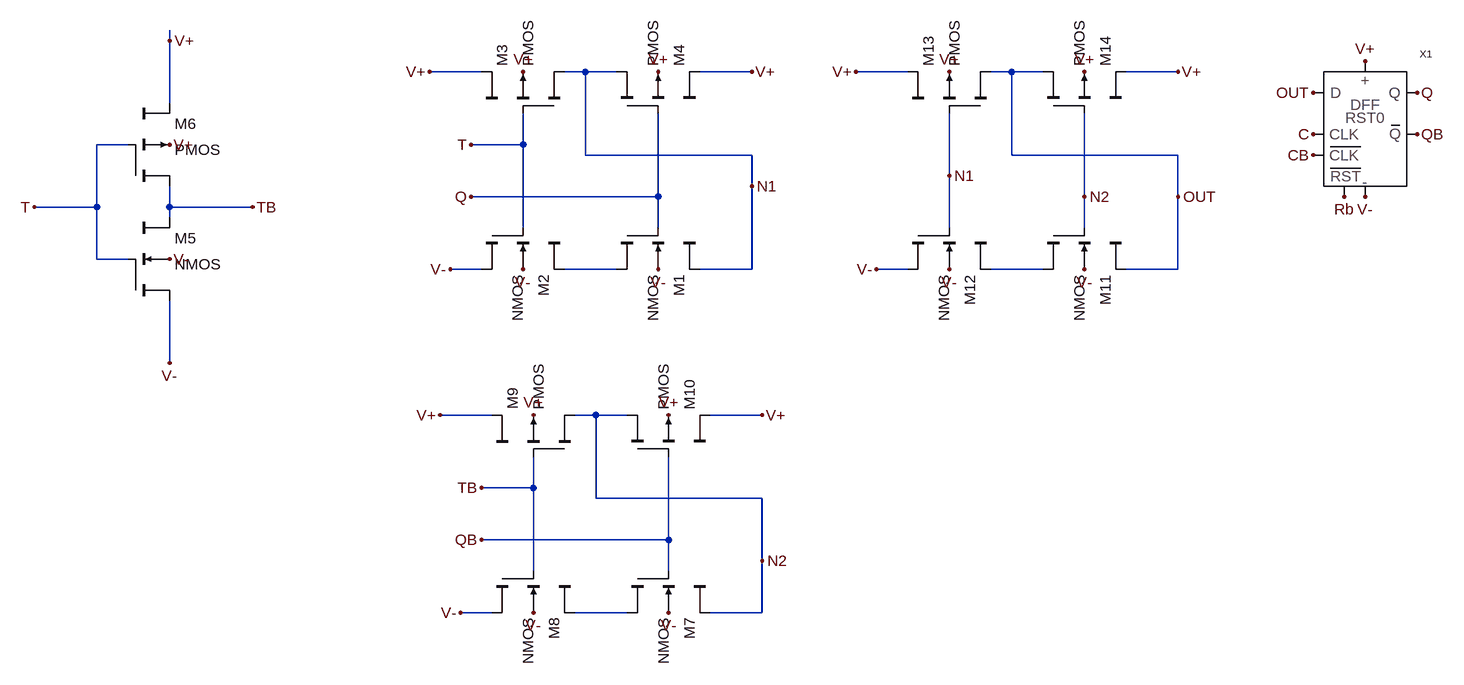
[diagram p0: schematic ToggleFlipFlop_Low_LDS.asc]
ToggleFlipFlop_Low_LDS.asc, the LTspice schematic file:
Version 4
SHEET 1 3292 1708
WIRE -1024 272 -1024 256
WIRE -544 320 -624 320
WIRE -384 320 -416 320
WIRE -336 320 -384 320
WIRE -128 320 -208 320
WIRE 112 320 32 320
WIRE 272 320 240 320
WIRE 320 320 272 320
WIRE 528 320 448 320
WIRE -1024 368 -1024 272
WIRE -1088 432 -1136 432
WIRE -480 432 -480 384
WIRE -480 432 -560 432
WIRE -384 448 -384 320
WIRE -128 448 -384 448
WIRE 272 448 272 320
WIRE 528 448 272 448
WIRE 176 480 176 384
WIRE -128 496 -128 448
WIRE -272 512 -272 384
WIRE -272 512 -560 512
WIRE 384 512 384 384
WIRE 528 512 528 448
WIRE -1136 528 -1136 432
WIRE -1136 528 -1232 528
WIRE -1024 528 -1024 496
WIRE -896 528 -1024 528
WIRE -1024 544 -1024 528
WIRE -480 560 -480 432
WIRE -272 560 -272 512
WIRE 176 560 176 480
WIRE 384 560 384 512
WIRE -1136 608 -1136 528
WIRE -1088 608 -1136 608
WIRE -544 624 -592 624
WIRE -336 624 -416 624
WIRE -128 624 -128 496
WIRE -128 624 -208 624
WIRE 112 624 64 624
WIRE 320 624 240 624
WIRE 528 624 528 512
WIRE 528 624 448 624
WIRE -1024 768 -1024 672
WIRE -528 848 -608 848
WIRE -368 848 -400 848
WIRE -320 848 -368 848
WIRE -112 848 -192 848
WIRE -464 960 -464 912
WIRE -464 960 -544 960
WIRE -368 976 -368 848
WIRE -112 976 -368 976
WIRE -256 1040 -256 912
WIRE -256 1040 -544 1040
WIRE -112 1072 -112 976
WIRE -464 1088 -464 960
WIRE -256 1088 -256 1040
WIRE -528 1152 -576 1152
WIRE -320 1152 -400 1152
WIRE -112 1152 -112 1072
WIRE -112 1152 -192 1152
FLAG -896 528 TB
FLAG -480 320 V+
FLAG -272 320 V+
FLAG -272 624 V-
FLAG -480 624 V-
FLAG -592 624 V-
FLAG -1024 272 V+
FLAG -1024 432 V+
FLAG -1024 768 V-
FLAG -1024 608 V-
FLAG -624 320 V+
FLAG -128 320 V+
FLAG -464 848 V+
FLAG -256 848 V+
FLAG -256 1152 V-
FLAG -464 1152 V-
FLAG -576 1152 V-
FLAG -608 848 V+
FLAG -112 848 V+
FLAG 176 320 V+
FLAG 384 320 V+
FLAG 384 624 V-
FLAG 176 624 V-
FLAG 64 624 V-
FLAG 32 320 V+
FLAG 528 512 OUT
FLAG 528 320 V+
FLAG -128 496 N1
FLAG -112 1072 N2
FLAG 384 512 N2
FLAG 176 480 N1
FLAG -560 512 Q
FLAG -544 1040 QB
FLAG -1232 528 T
FLAG -544 960 TB
FLAG -560 432 T
FLAG 736 416 C
FLAG 736 448 CB
FLAG 784 512 Rb
FLAG 816 304 V+
FLAG 816 512 V-
FLAG 896 352 Q
FLAG 896 416 QB
FLAG 736 352 OUT
SYMBOL cktsym\\nmos4 -272 624 R90
SYMATTR InstName M1
SYMATTR Value2 l=0.9u w=3u
SYMBOL cktsym\\nmos4 -480 624 R90
SYMATTR InstName M2
SYMATTR Value2 l=0.9u w=3u
SYMBOL cktsym\\pmos4 -480 320 R270
SYMATTR InstName M3
SYMATTR Value2 l=0.9u w=6u
SYMBOL cktsym\\pmos4 -272 320 M270
SYMATTR InstName M4
SYMATTR Value2 l=0.9u w=6u
SYMBOL cktsym\\nmos4 -1024 608 R0
SYMATTR InstName M5
SYMATTR Value2 l=0.9u w=3u
SYMBOL cktsym\\pmos4 -1024 432 R0
SYMATTR InstName M6
SYMATTR Value2 l=0.9u w=6u
SYMBOL cktsym\\nmos4 -256 1152 R90
SYMATTR InstName M7
SYMATTR Value2 l=0.9u w=3u
SYMBOL cktsym\\nmos4 -464 1152 R90
SYMATTR InstName M8
SYMATTR Value2 l=0.9u w=3u
SYMBOL cktsym\\pmos4 -464 848 R270
SYMATTR InstName M9
SYMATTR Value2 l=0.9u w=6u
SYMBOL cktsym\\pmos4 -256 848 M270
SYMATTR InstName M10
SYMATTR Value2 l=0.9u w=6u
SYMBOL cktsym\\nmos4 384 624 R90
SYMATTR InstName M11
SYMATTR Value2 l=0.9u w=3u
SYMBOL cktsym\\nmos4 176 624 R90
SYMATTR InstName M12
SYMATTR Value2 l=0.9u w=3u
SYMBOL cktsym\\pmos4 176 320 R270
SYMATTR InstName M13
SYMATTR Value2 l=0.9u w=6u
SYMBOL cktsym\\pmos4 384 320 M270
SYMATTR InstName M14
SYMATTR Value2 l=0.9u w=6u
SYMBOL ResetFlipFlop_Low_LDS 816 416 R0
SYMATTR InstName X1

The netlist it stands for:
* ToggleFlipFlop_Low_LDS.asc
M1 N1 Q N001 V- NMOS l=0.9u w=3u
M2 N001 T V- V- NMOS l=0.9u w=3u
M3 N1 T V+ V+ PMOS l=0.9u w=6u
M4 N1 Q V+ V+ PMOS l=0.9u w=6u
M5 TB T V- V- NMOS l=0.9u w=3u
M6 TB T V+ V+ PMOS l=0.9u w=6u
M7 N2 QB N003 V- NMOS l=0.9u w=3u
M8 N003 TB V- V- NMOS l=0.9u w=3u
M9 N2 TB V+ V+ PMOS l=0.9u w=6u
M10 N2 QB V+ V+ PMOS l=0.9u w=6u
M11 OUT N2 N002 V- NMOS l=0.9u w=3u
M12 N002 N1 V- V- NMOS l=0.9u w=3u
M13 OUT N1 V+ V+ PMOS l=0.9u w=6u
M14 OUT N2 V+ V+ PMOS l=0.9u w=6u
XX1 OUT C CB Q QB Rb V+ V- ResetFlipFlop_Low_LDS  ; pins D CLK CLKb Q Qb RESETb pos neg
.model NMOS NMOS
.model PMOS PMOS
.lib standard.mos
.backanno
.end